# Altium schematic sheet NHD-1.27-12896UGC3.SchDoc
size A4; SheetNumber: 8; SheetTotal: 10
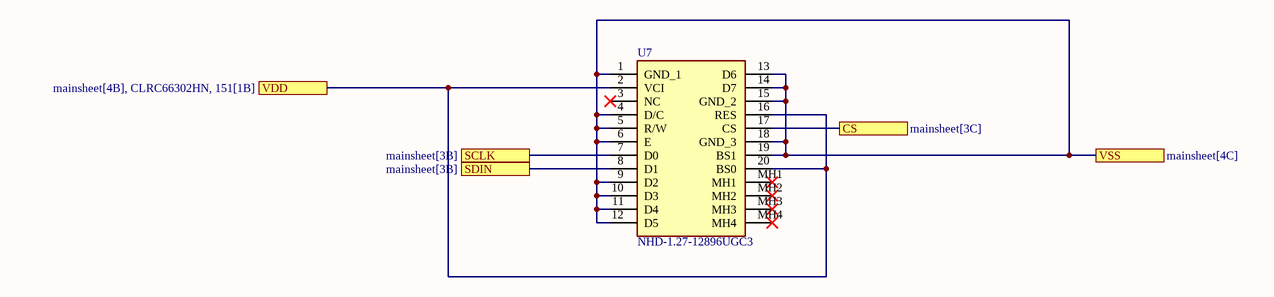
[diagram p0: NHD-1.27-12896UGC3.SchDoc]

## Parts
U7  NHD-1.27-12896UGC3  [NHD12712896UGC3]

## Ports
CS (see mainsheet[3C]), SCLK (see mainsheet[3B]), SDIN (see mainsheet[3B]), VDD (see mainsheet[4B], CLRC66302HN, 151[1B]), VSS (see mainsheet[4C])

## Nets
CS: U7.17(CS) ; port CS
SCLK: U7.7(D0) ; port SCLK
SDIN: U7.8(D1) ; port SDIN
VDD: U7.2(VCI) U7.16(RES) U7.20(BS0) ; port VDD
VSS: U7.1(GND_1) U7.4(D/C) U7.5(R/W) U7.6(E) U7.9(D2) U7.10(D3) U7.11(D4) U7.12(D5) U7.13(D6) U7.14(D7) U7.15(GND_2) U7.18(GND_3) U7.19(BS1) ; port VSS

Not connected (* = marked no-connect by the designer): U7 3(NC)* MH1* MH2* MH3* MH4*

## Library data of the parts
U7 = NHD-1.27-12896UGC3: Display; Manufacturer_Name: Newhaven Display; Datasheet Link: https://www.newhavendisplay.com/specs/NHD-1.27-12896UGC3.pdf; Height: 5.4mm; Manufacturer_Part_Number: NHD-1.27-12896UGC3; Mouser Part Number: 763-NHD1.2712896UGC3; Mouser Price/Stock: https://www.mouser.co.uk/ProductDetail/Newhaven-Display/NHD-127-12896UGC3?qs=6DDkx98%252BHnCcf5K23TlgNg%3D%3D